# EAGLE design nrfMysensor (EAGLE 6.5.0)
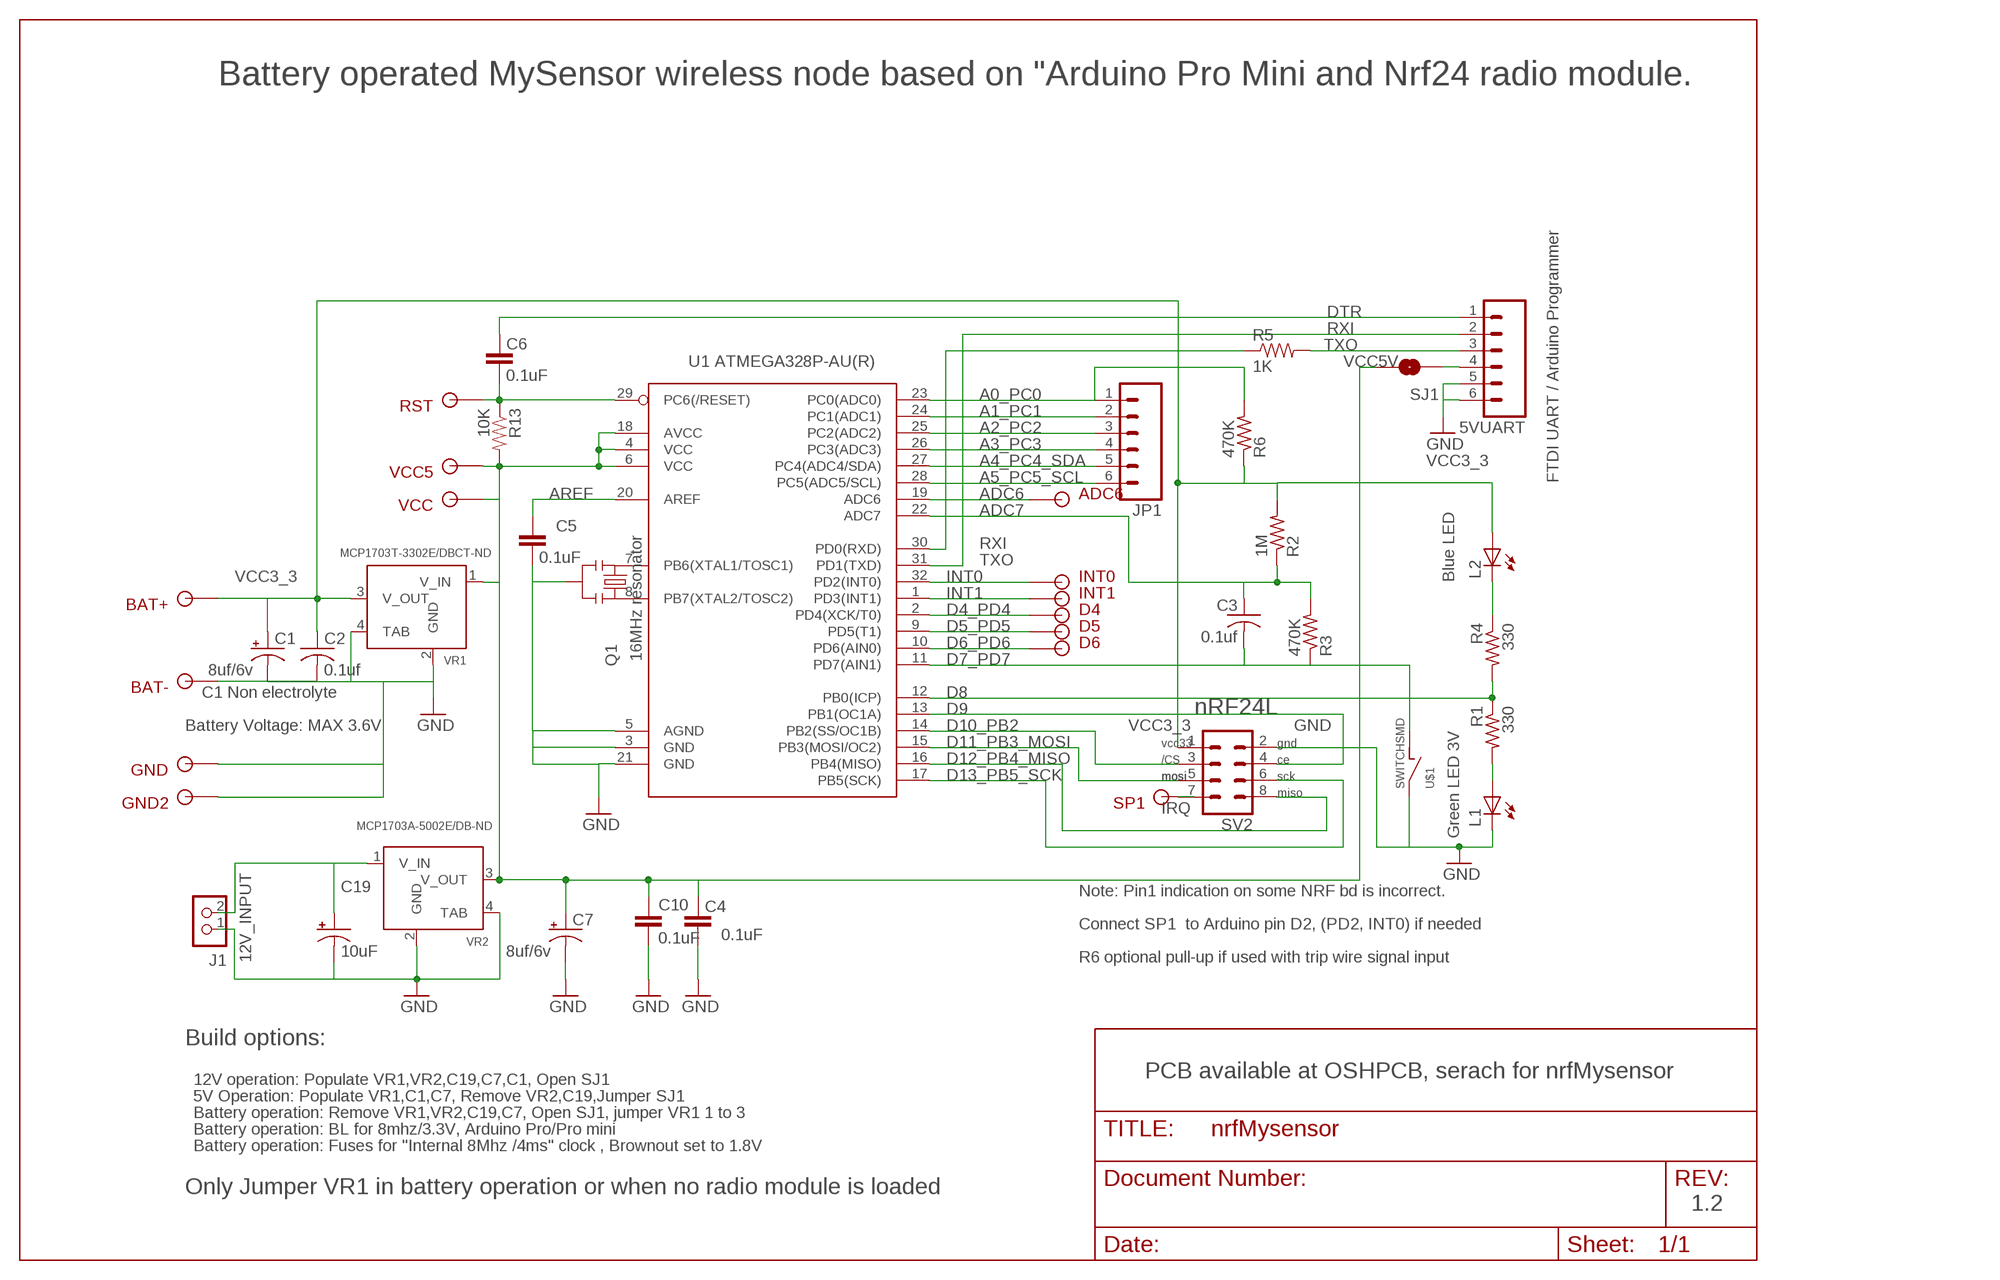
[diagram p0: schematic, sheet 1]

## Parts
5VUART  M06SIP  [1X06]
ADC6  SOLDER_POINTA  [P1-13]
BAT+  SOLDER_POINTA  [P1-13]
BAT-  SOLDER_POINTA  [P1-13]
C1  8uf/6v  CPOL-USSMCB  [SMC_B]
C2  0.1uf  C-USC0805  [C0805]
C3  0.1uf  C-USC0805  [C0805]
C4  0.1uF  CAP0805  [0805]
C5  0.1uF  CAP0805  [0805]
C6  0.1uF  CAP0805  [0805]
C7  8uf/6v  CPOL-USSMCB  [SMC_B]
C10  0.1uF  CAP0805  [0805]
C19  10uF  CAP_POL7343  [EIA7343]
D4  SOLDER_POINTA  [P1-13]
D5  SOLDER_POINTA  [P1-13]
D6  SOLDER_POINTA  [P1-13]
GND  SOLDER_POINTA  [P1-13]
GND2  SOLDER_POINTA  [P1-13]
INT0  SOLDER_POINTA  [P1-13]
INT1  SOLDER_POINTA  [P1-13]
J1  12V input  CON_HEADER_1X02-PTH  [M1X2]
JP1  M06SIP  [1X06]
L1  LEDSML0603  [SML0603]
L2  LEDSML0603  [SML0603]
Q1  16MHz resonator  RESONATORSMD  [RESONATOR-SMD]
R1  330  R-US_R0603  [R0603]
R2  1M  R-US_R0603  [R0603]
R3  470K  R-US_R0603  [R0603]
R4  330  R-US_R0603  [R0603]
R5  1K  RESISTOR0603  [0603]
R6  470K  R-US_R0603  [R0603]
R13  10K  RESISTOR0603  [0603]
RST  SOLDER_POINTA  [P1-13]
SJ1  SOLDERJUMPERNO  [SJ_2S-NO]
SP1  SOLDER_POINTA  [P1-13]
SV2  MA04-2  [MA04-2]
U1  ATMEGA328P-AU(R)  ATMEGA168  [TQFP32-08]
U$1  SWITCHSMD  [SMD_SWITCH]
VCC  SOLDER_POINTA  [P1-13]
VCC5  SOLDER_POINTA  [P1-13]
VR1  MCP1703T-3302E/DBCT-ND  MCP1703ASOT223  [SOT223]
VR2  MCP1703A-5002E/DB-ND  MCP1703ASOT223  [SOT223]

## Nets
5V: C4.2 C7.+ C10.1 R13.2 SJ1.1 U1.4(VCC) U1.6(VCC) U1.18(AVCC) VCC5.1 VCC.1 VR1.1(V_IN) VR2.3(V_OUT)
12V_INPUT: C19.A(+) J1.2 VR2.1(V_IN)
A0_PC0: JP1.1 R6.2 U1.23(PC0(ADC0))
A1_PC1: JP1.2 U1.24(PC1(ADC1))
A2_PC2: JP1.3 U1.25(PC2(ADC2))
A3_PC3: JP1.4 U1.26(PC3(ADC3))
A4_PC4_SDA: JP1.5 U1.27(PC4(ADC4/SDA))
A5_PC5_SCL: JP1.6 U1.28(PC5(ADC5/SCL))
ADC6: ADC6.1 U1.19(ADC6)
ADC7: C3.1 R2.1 R3.2 U1.22(ADC7)
AREF: C5.2 U1.20(AREF)
D4_PD4: D4.1 U1.2(PD4(XCK/T0))
D5_PD5: D5.1 U1.9(PD5(T1))
D6_PD6: D6.1 U1.10(PD6(AIN0))
D7_PD7: C3.2 R3.1 U1.11(PD7(AIN1)) U$1.P$1
D8: R1.1 R4.2 U1.12(PB0(ICP))
D9: SV2.4 U1.13(PB1(OC1A))
D10_PB2: SV2.3 U1.14(PB2(SS/OC1B))
D11_PB3_MOSI: SV2.5 U1.15(PB3(MOSI/OC2))
D12_PB4_MISO: SV2.8 U1.16(PB4(MISO))
D13_PB5_SCK: SV2.6 U1.17(PB5(SCK))
GND: 5VUART.5 5VUART.6 BAT-.1 C1.- C2.2 C4.1 C5.1 C7.- C10.2 C19.C(-) GND2.1 GND.1 J1.1 L1.C Q1.2 SV2.2 U1.3(GND) U1.5(AGND) U1.21(GND) U$1.P$2 VR1.2(GND) VR1.4(TAB) VR2.2(GND) VR2.4(TAB)
INT0: INT0.1 U1.32(PD2(INT0))
INT1: INT1.1 U1.1(PD3(INT1))
IRQ: SP1.1 SV2.7
N$1: L1.A R1.2
N$2: L2.C R4.1
N$3: 5VUART.3 R5.2
N$4: 5VUART.4 SJ1.2
N$5: Q1.1 U1.8(PB7(XTAL2/TOSC2))
N$6: 5VUART.1 C6.2
N$9: Q1.3 U1.7(PB6(XTAL1/TOSC1))
RESET: C6.1 R13.1 RST.1 U1.29(PC6(/RESET))
RXI: R5.1 U1.30(PD0(RXD))
TXO: 5VUART.2 U1.31(PD1(TXD))
VCC3_3: BAT+.1 C1.+ C2.1 L2.A R2.2 R6.1 SV2.1 VR1.3(V_OUT)

## Notes on the sheet
- Battery operated MySensor wireless node based on "Arduino Pro Mini and Nrf24 radio module.
- DTR
- RXI
- TXO
- VCC5V
- FTDI UART / Arduino Programmer
- Blue LED
- C1 Non electrolyte
- nRF24L
- Battery Voltage: MAX 3.6V | Green LED 3V
- vcc33 | gnd
- /CS | ce
- mosi | mosi | sck
- miso
- Note: Pin1 indication on some NRF bd is incorrect.
- Connect SP1  to Arduino pin D2, (PD2, INT0) if needed
- R6 optional pull-up if used with trip wire signal input
- Build options:
- PCB available at OSHPCB, serach for nrfMysensor
- 12V operation: Populate VR1,VR2,C19,C7,C1, Open SJ1
- 5V Operation: Populate VR1,C1,C7, Remove VR2,C19,Jumper SJ1
- Battery operation: Remove VR1,VR2,C19,C7, Open SJ1, jumper VR1 1 to 3
- Battery operation: BL for 8mhz/3.3V, Arduino Pro/Pro mini
- Battery operation: Fuses for "Internal 8Mhz /4ms" clock , Brownout set to 1.8V
- Only Jumper VR1 in battery operation or when no radio module is loaded
- 1.2

## Library data of the parts
5VUART JP1 = SparkFun-Connectors:M06: Header 6 Standard 6-pin 0.1" header. Use with straight break away headers (SKU : PRT-00116), right angle break away headers (PRT-00553), swiss pins (PRT-00743), machine pins (PRT-00117), and female headers (PRT-00115). Molex polarized connector foot print use with SKU : PRT-08094 with associated crimp pins and housings. NOTES ON THE VARIANTS LOCK and LOCK_LONGPADS... This footprint was designed to help hold the alignment of a through-hole component (i.e. 6-pin header) while soldering it into place. You may notice that each hole has been shifted either up or down by 0.005 of an inch from it's more standard position (which is a perfectly straight line). This slight alteration caused the pins (the squares in the middle) to touch the edges of the holes. Because they are alternating, it causes a "brace" to hold the component in place. 0.005 has proven to be the perfect amount of "off-center" position when using our standard breakaway headers. Although looks a little odd when you look at the bare footprint, once you have a header in there, the alteration is very hard to notice. Also, if you push a header all the way into place, it is covered up entirely on the bottom side. This idea of altering the position of holes to aid alignment will be further integrated into the Sparkfun Library for other footprints. It can help hold any component with 3 or more connection pins.
ADC6 BAT+ BAT- D4-D6 GND GND2 INT0 INT1 RST SP1 VCC VCC5 = 1AA_Stofer:SOLDER_POINT
C1 C7 = rcl:CPOL-US: POLARIZED CAPACITOR, American symbol
C2 C3 = rcl:C-US: CAPACITOR, American symbol
C4-C6 C10 = SparkFun:CAP: Capacitor Standard 0603 ceramic capacitor, and 0.1" leaded capacitor.
C19 = SparkFun:CAP_POL: Capacitor Polarized These are standard SMD and PTH capacitors. Normally 10uF, 47uF, and 100uF in electrolytic and tantalum varieties. Always verify the external diameter of the through hole cap, it varies with capacity, voltage, and manufacturer. The EIA devices should be standard.
J1 = dp_devices:CON_HEADER_1X02
L1 L2 = led:LED: LED OSRAM: - CHIPLED LG R971, LG N971, LY N971, LG Q971, LY Q971, LO R971, LY R971 LH N974, LH R974 LS Q976, LO Q976, LY Q976 LO Q996 - Hyper CHIPLED LW Q18S LB Q993, LB Q99A, LB R99A - SideLED LS A670, LO A670, LY A670, LG A670, LP A670 LB A673, LV A673, LT A673, LW A673 LH A674 LY A675 LS A676, LA A676, LO A676, LY A676, LW A676 LS A679, LY A679, LG A679 - Hyper Micro SIDELED® LS Y876, LA Y876, LO Y876, LY Y876 LT Y87S - SmartLED LW L88C, LW L88S LB L89C, LB L89S, LG L890 LS L89K, LO L89K, LY L89K LS L896, LA L896, LO L896, LY L896 - TOPLED LS T670, LO T670, LY T670, LG T670, LP T670 LSG T670, LSP T670, LSY T670, LOP T670, LYG T670 LG T671, LOG T671, LSG T671 LB T673, LV T673, LT T673, LW T673 LH T674 LS T676, LA T676, LO T676, LY T676, LB T676, LH T676, LSB T676, LW T676 LB T67C, LV T67C, LT T67C, LS T67K, LO T67K, LY T67K, LW E67C LS E67B, LA E67B, LO E67B, LY E67B, LB E67C, LV E67C, LT E67C LW T67C LS T679, LY T679, LG T679 LS T770, LO T770, LY T770, LG T770, LP T770 LB T773, LV T773, LT T773, LW T773 LH T774 LS E675, LA E675, LY E675, LS T675 LS T776, LA T776, LO T776, LY T776, LB T776 LHGB T686 LT T68C, LB T68C - Hyper Mini TOPLED® LB M676 - Mini TOPLED Santana® LG M470 LS M47K, LO M47K, LY M47K Source: http://www.osram.convergy.de LUXEON: - LUMILED® LXK2-PW12-R00, LXK2-PW12-S00, LXK2-PW14-U00, LXK2-PW14-V00 LXK2-PM12-R00, LXK2-PM12-S00, LXK2-PM14-U00 LXK2-PE12-Q00, LXK2-PE12-R00, LXK2-PE12-S00, LXK2-PE14-T00, LXK2-PE14-U00 LXK2-PB12-K00, LXK2-PB12-L00, LXK2-PB12-M00, LXK2-PB14-N00, LXK2-PB14-P00, LXK2-PB14-Q00 LXK2-PR12-L00, LXK2-PR12-M00, LXK2-PR14-Q00, LXK2-PR14-R00 LXK2-PD12-Q00, LXK2-PD12-R00, LXK2-PD12-S00 LXK2-PH12-R00, LXK2-PH12-S00 LXK2-PL12-P00, LXK2-PL12-Q00, LXK2-PL12-R00 Source: www.luxeon.com KINGBRIGHT: KA-3528ASYC Source: www.kingbright.com
Q1 = SparkFun:RESONATOR: Resonator Small SMD resonator. This is the itty bitty 10/20MHz resonators with built in caps. CSTCE10M0G55 and CSTCE20M0V53. Footprint has been reviewed closely but hasn't been tested yet.
R1-R4 R6 = rcl:R-US_: RESISTOR, American symbol
R5 R13 = SparkFun:RESISTOR: Resistor Basic schematic elements and footprints for 0603, 1206, and PTH 1/10th watt (small) resistors.
SJ1 = SparkFun-Passives:SOLDERJUMPER: Solder Jumper Standard SMD solder jumper. Used to automate production. Two varients : Normally Open and Normally Closed are the same, but have different paste layers. NC will have a large amount of paste and should jumper during reflow.
SV2 = con-lstb:MA04-2: PIN HEADER; OC_FARNELL: unknown; OC_NEWARK: unknown
U1 = SparkFun:ATMEGA168
U$1 = 1AA_Stofer:SWITCH
VR1 VR2 = 1AA_Stofer:MCP1703A

## Board
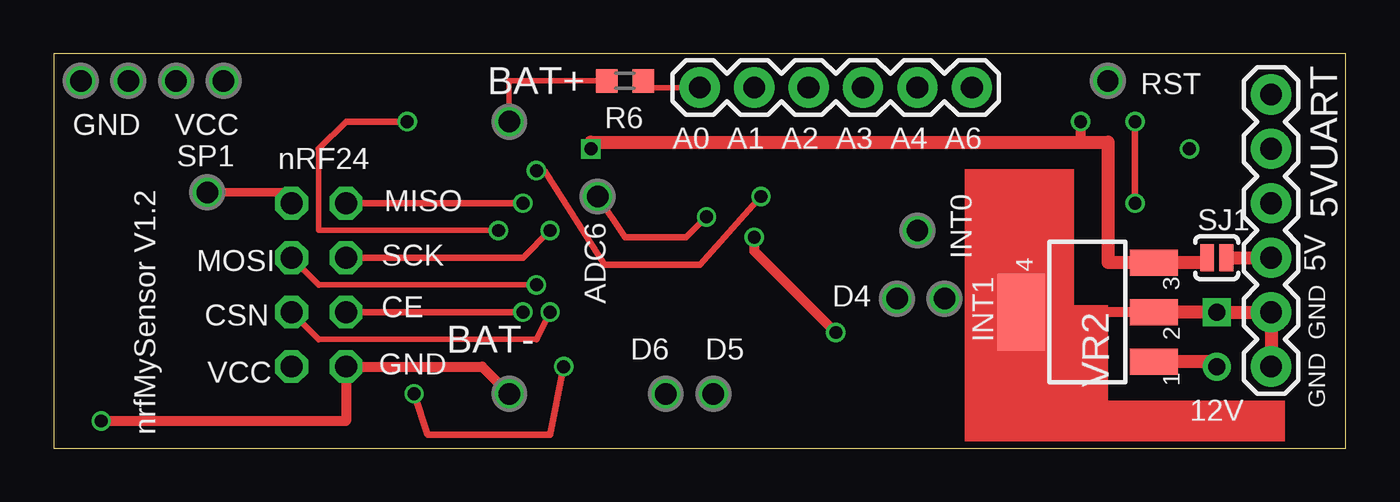
[diagram p1: board, top side]
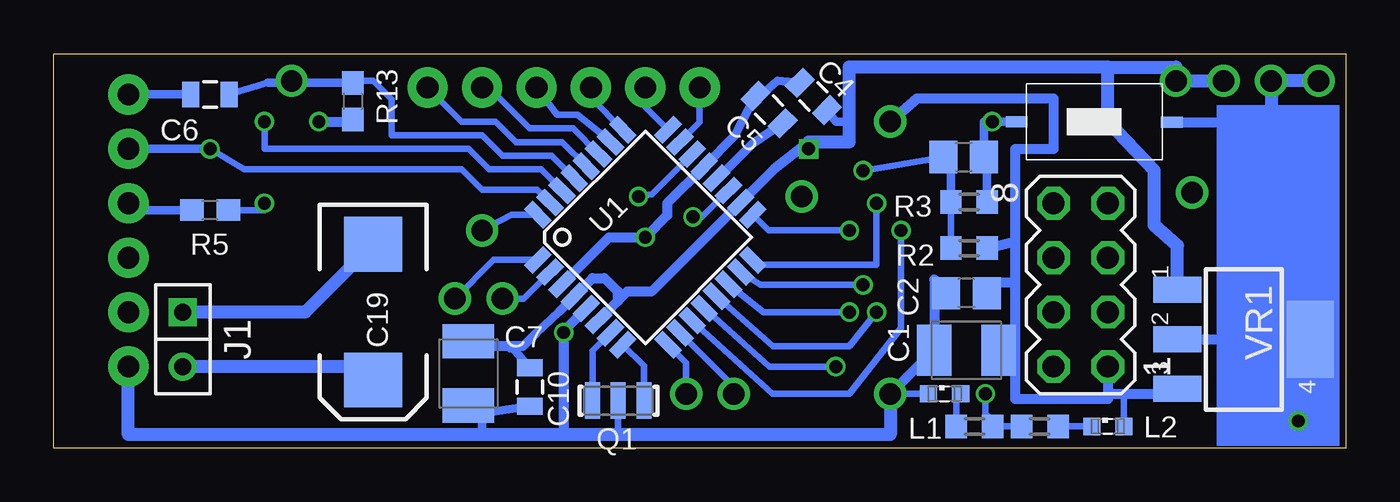
[diagram p2: board, bottom side, seen from below]

Size 60.32 x 18.41 mm. Coordinates in mm from the lower left corner, seen from the top.
Outline: 0,0 60.32,0 60.32,18.41 0,18.41 0,0
Copper layers (1*16): Top 0.035mm / dielectric 1.5mm / Bottom 0.035mm
Design rules "Elecrow_2-layer_eagle_rule": minimum track width 6mil, minimum drill 12mil, track to track 6mil, track to pad 6mil, pad to pad 6mil, via to via 6mil, smd to smd 0mil, copper to edge 10mil, drill to drill 10mil, minimum pad ring 10mil, minimum via ring 6mil, stop-mask expansion 2mil, vias tented up to drill 100mil, thermal gap 10mil

### Footprints (pad centres in the part's own frame; a part is rotated, then mirrored left to right if it is on the bottom)
1X06 = drill 1.016 pad 1.88: 1 0,0; 2 2.54,0; 3 5.08,0; 4 7.62,0; 5 10.16,0; 6 12.7,0
P1-13 = drill 1: 1 0,0
SMC_B = smd 1.6 x 2.4: + -1.5,0; - 1.5,0
C0805 = smd 1.3 x 1.5: 1 -0.95,0; 2 0.95,0
0805 = smd 0.8 x 1.2: 1 -0.9,0; 2 0.9,0
EIA7343 = smd 2.55 x 2.7: A 3.17,0; C -3.17,0
M1X2 = drill 0.8 square: 1 -1.27,0 | drill 0.8: 2 1.27,0
SML0603 = smd 0.8 x 0.8: A 0.75,0; C -0.75,0
RESONATOR-SMD = smd 0.7 x 1.7: 1 -1.2,0; 2 0,0; 3 1.2,0
R0603 = smd 1 x 1.1: 1 -0.85,0; 2 0.85,0
0603 = smd 1.1 x 1: 1 -0.85,0; 2 0.85,0
SJ_2S-NO = smd 0.635 x 1.27: 1 -0.45,0; 2 0.45,0
MA04-2 = drill 1.016 octagon: 1 -3.81,-1.27; 2 -3.81,1.27; 3 -1.27,-1.27; 4 -1.27,1.27; 5 1.27,-1.27; 6 1.27,1.27; 7 3.81,-1.27; 8 3.81,1.27
TQFP32-08 = smd 1.27 x 0.559: 1 -4.293,2.8; 2 -4.293,2; 3 -4.293,1.2; 4 -4.293,0.4; 5 -4.293,-0.4; 6 -4.293,-1.2; 7 -4.293,-2; 8 -4.293,-2.8; 17 4.293,-2.8; 18 4.293,-2; 19 4.293,-1.2; 20 4.293,-0.4; 21 4.293,0.4; 22 4.293,1.2; 23 4.293,2; 24 4.293,2.8 | smd 0.559 x 1.27: 9 -2.8,-4.293; 10 -2,-4.293; 11 -1.2,-4.293; 12 -0.4,-4.293; 13 0.4,-4.293; 14 1.2,-4.293; 15 2,-4.293; 16 2.8,-4.293; 25 2.8,4.293; 26 2,4.293; 27 1.2,4.293; 28 0.4,4.293; 29 -0.4,4.293; 30 -1.2,4.293; 31 -2,4.293; 32 -2.8,4.293
SMD_SWITCH = smd 1.016 x 0.508: P$1 -4.259,-0.005; P$2 2.988,-0.021
SOT223 = smd 1.219 x 2.235: 1 -2.311,-3.099; 2 0,-3.099; 3 2.311,-3.099 | smd 3.6 x 2.2: 4 0,3.099

### Placement (x,y rotation side)
5VUART  56.83,16.51 270 top
ADC6  25.4,11.75 0 top
BAT+  21.27,15.24 0 top
BAT-  21.27,2.54 0 top
C1  17.72,4.57 180 bottom
C2  17.72,7.24 180 bottom
C3  17.84,13.59 0 bottom
C4  24.86,16.42 315 bottom
C5  26.93,15.8 315 bottom
C6  53.02,16.51 180 bottom
C7  40.96,3.49 270 bottom
C10  38.1,2.86 270 bottom
C19  45.4,6.35 270 bottom
D4  39.37,6.99 0 top
D5  30.8,2.54 0 top
D6  28.57,2.54 0 top
GND  1.27,17.14 0 top
GND2  3.49,17.14 0 top
INT0  40.32,10.16 0 top
INT1  41.59,6.99 0 top
J1  54.29,5.08 270 bottom
JP1  30.16,16.83 0 top
L1  18.73,2.54 0 bottom
L2  11.11,1.02 0 bottom
Q1  33.97,2.22 180 bottom
R1  17.34,1.02 180 bottom
R2  17.59,9.33 0 bottom
R3  17.59,11.49 180 bottom
R4  14.29,1.02 180 bottom
R5  53.02,11.11 180 bottom
R6  26.67,17.14 0 top
R13  46.35,16.19 270 bottom
RST  49.21,17.14 0 top
SJ1  54.29,8.89 0 top
SP1  7.18,11.94 0 top
SV2  12.38,7.62 90 bottom
U1  32.7,9.84 45 bottom
U$1  11.11,15.24 0 bottom
VCC  5.71,17.14 0 top
VCC5  7.94,17.14 0 top
VR1  4.76,5.08 270 bottom
VR2  48.26,6.35 90 top

### Tracks (layer width: path | path; a pad name or v marks a point on that pad's centre or on a via)
5V  (via drill 0.6)
  Top 0.457: 47.94,14.29 v47.94,15.24
  Top 0.61: SJ1.1 53.61,8.66 VR2.3 49.23,8.66 49.23,14.29 47.94,14.29 25.08,14.29 v25.08,13.97
  Bottom 0.406: C4.2 23.81,15.24 23.18,15.24 | U1.4 36.76,6.35 37.78,5.4 38.42,4.76 | 38.92,4.71 C10.1
  Bottom 0.457: U1.4 35.17,7.94 34.61,7.94 33.97,7.3 33.97,6.88 U1.6 33.55,7.3 32.41,7.3 U1.18 26.7,13.02 25.08,14.29 | v47.94,15.24 46.46,15.24 R13.2 | 38.42,4.76 39.05,4.76 | 39.05,4.76 40.73,4.76 C7.+ | 38.92,4.71 39,4.71 39.05,4.76
  Bottom 0.61: VR1.1 7.86,9.45 8.95,10.41 8.95,12.95 11.11,15.24 11.11,17.78 | 11.11,17.78 23.18,17.78 23.18,15.24 23.18,14.29 25.08,14.29 v25.08,13.97 | 11.11,17.78 7.94,17.78 VCC5.1 VCC.1
12V_INPUT
  Top 0.61: J1.2 54.06,4.04 VR2.1
  Bottom 0.61: C19.A 46.03,3.81 J1.2
A0_PC0
  Top 0.254: JP1.1 27.52,16.83 R6.2
  Bottom 0.305: U1.23 30.16,15.21 JP1.1
A1_PC1
  Bottom 0.305: U1.24 32.7,15.91 JP1.2
A2_PC2
  Bottom 0.305: U1.25 35.24,16.34 JP1.3
A3_PC3
  Bottom 0.305: U1.26 34.32,14.32 35.88,15.56 36.83,15.56 JP1.4
A4_PC4_SDA
  Bottom 0.305: U1.27 36.09,14.92 38.1,14.92 40,16.83 JP1.5
A5_PC5_SCL
  Bottom 0.305: U1.28 36.58,14.29 38.74,14.29 39.69,15.24 41.28,15.24 JP1.6
ADC6  (via drill 0.6)
  Top 0.305: v30.48,10.79 29.53,9.84 26.67,9.84 ADC6.1
  Bottom 0.305: U1.19 30.05,10.79 v30.48,10.79
ADC7  (via drill 0.6)
  Top 0.305: v33.02,11.75 30.16,8.57 25.72,8.57 22.92,12.95 v22.54,12.95
  Bottom 0.305: R3.2 R2.1 | C3.1 v22.54,12.95 | U1.22 32.39,11.86 v33.02,11.75
  Bottom 0.406: R3.2 18.44,12.95 C3.1
AREF
  Bottom 0.305: 29.32,12.6 U1.20
  Bottom 0.406: 29.32,12.6 27.7,14.21 C5.2
D4_PD4
  Bottom 0.305: U1.2 38.39,6.99 D4.1
D5_PD5
  Bottom 0.305: U1.9 30.8,3.98 D5.1
D6_PD6
  Bottom 0.305: U1.10 28.56,2.87 | 28.56,2.87 28.26,2.57 | D6.1 28.57,2.86 28.56,2.87
D7_PD7  (via drill 0.6)
  Top 0.254: 12.38,13.97 12.38,10.16 v20.76,10.16
  Top 0.305: v16.51,15.24 13.65,15.24 12.38,13.97
  Bottom 0.305: 16.89,15.23 16.9,15.24 v16.51,15.24 | v20.76,10.16 20.76,5.59 23.18,2.54 26.78,2.54 U1.11
  Bottom 0.406: U$1.P$1 16.89,15.23 C3.2 16.77,12.83 16.77,11.33 R3.1
D8  (via drill 0.6)
  Top 0.305: v16.83,2.54 17.46,0.64 23.18,0.64 v23.81,3.81
  Bottom 0.305: R4.2 R1.1 16.49,1.27 16.83,1.61 v16.83,2.54 | U1.12 26.92,3.81 v23.81,3.81
D9  (via drill 0.6)
  Top 0.305: v21.91,6.35 SV2.4
  Bottom 0.305: U1.13 26.74,4.76 23.18,4.76 v21.91,6.35
D10_PB2  (via drill 0.6)
  Top 0.254: 12.38,5.08 22.54,5.08
  Top 0.305: SV2.3 12.38,5.08 | v23.18,6.35 22.54,5.08
  Bottom 0.305: U1.14 27.2,6.35 v23.18,6.35
D11_PB3_MOSI  (via drill 0.6)
  Top 0.254: 12.38,7.62 v22.54,7.62
  Top 0.305: 12.38,7.62 SV2.5
  Bottom 0.305: U1.15 27.33,7.62 v22.54,7.62
D12_PB4_MISO  (via drill 0.6)
  Top 0.305: v21.91,11.43 SV2.8
  Bottom 0.305: U1.16 27.47,8.57 21.91,8.57 v21.91,11.43
D13_PB5_SCK  (via drill 0.6)
  Top 0.305: SV2.6 21.91,8.89 v23.18,10.16
  Bottom 0.305: U1.17 26.95,10.16 v23.18,10.16
GND  (via drill 0.6)
  Top 0.457: BAT-.1 20,3.81 SV2.2 13.65,1.27 v2.22,1.27 | v32.7,9.84 32.7,9.21 v36.51,5.4 | VR2.2 VR2.4
  Top 0.61: VR2.2 J1.1 5VUART.5 5VUART.6
  Bottom 0.305: L1.C BAT-.1 | Q1.2 33.97,0.64
  Bottom 0.406: C4.1 26.54,17.14 27.62,16.19 27.38,16.44 C5.1 28.52,14.59 U1.21 | C10.2 40.32,1.64 40.32,1.27 40.32,0.64
  Bottom 0.457: VR1.2 3.49,5.08 | 3.49,5.08 2.22,5.08 | 2.22,5.08 VR1.4 | U$1.P$2 3.49,15.22 | 3.49,15.22 3.49,15.24 | 3.49,15.22 3.49,5.08 | v2.22,1.27 2.22,5.08 | C2.2 19.22,7.87 C1.- 19.75,4.06 BAT-.1 | U1.21 31.68,11.43 31.68,10.86 v32.7,9.84 34.4,9.84 U1.3 | U1.5 36.51,5.47 v36.51,5.4 36.51,0.64 | C7.- 40.32,1.99 40.32,1.27
  Bottom 0.61: BAT-.1 21.27,0.64 33.97,0.64 36.51,0.64 40.32,0.64 56.83,0.64 5VUART.6 | C19.C 48.57,6.35 J1.1 | GND.1 GND2.1 3.49,15.24
INT0
  Bottom 0.305: U1.32 38.95,10.9 INT0.1
INT1
  Bottom 0.305: U1.1 39.79,8.79 INT1.1
IRQ
  Top 0.406: SV2.7 arc90 10.6,11.94 SP1.1
N$1
  Bottom 0.305: L1.A 18.19,2.34 R1.2
N$2
  Bottom 0.305: L2.C R4.1
N$3
  Bottom 0.406: R5.2 56.83,11.11 5VUART.3
N$4
  Top 0.61: SJ1.2 5VUART.4
N$5
  Bottom 0.305: U1.8 32.77,3.84 Q1.1
N$6
  Bottom 0.406: C6.2 5VUART.1
N$9
  Bottom 0.305: U1.7 35.17,4.54 Q1.3
RESET
  Bottom 0.305: U1.29 37.08,13.65 39.37,13.65 40.32,14.61 44.55,14.61 44.55,16.3 45.4,17.14 46.25,17.14 R13.1 | 50.32,17.04 C6.1
  Bottom 0.406: R13.1 49.21,17.04 | 50.32,17.04 49.21,17.04 | 49.21,17.04 RST.1
RXI  (via drill 0.6)
  Top 0.305: v50.48,11.43 v50.48,15.24
  Bottom 0.305: U1.30 37.57,13.02 40,13.02 40.96,13.97 50.48,13.97 v50.48,15.24 | R5.1 50.48,11.11 v50.48,11.43
TXO  (via drill 0.6)
  Bottom 0.305: U1.31 37.75,12.07 40.32,12.07 41.28,13.02 51.43,13.02 v53.02,13.97
  Bottom 0.406: v53.02,13.97 5VUART.2
VCC3_3
  Top 0.254: R6.1 21.27,17.14 BAT+.1
  Bottom 0.305: L2.A 10.36,2.54 9.84,2.54
  Bottom 0.457: 11.11,2.54 9.84,2.54 7.3,2.54 7.3,2.77 VR1.3 | BAT+.1 20,16.32 13.65,16.32 13.65,13.97 15.43,13.97 15.43,9.65 | SV2.1 11.11,2.54 | 15.43,5.08 15.43,2.29 11.11,2.29 11.11,2.54 | 15.43,5.08 15.43,7.75 | 15.43,7.75 15.43,9.65 | C1.+ 15.43,5.08 | C2.1 16.64,7.75 15.43,7.75 | R2.2 15.43,9.65
(copper drawn outside any net)
  shapes: Bottom area x1, Top area x3

### Text on the board
tPlace: nRF24
tNames: A0 | A1 | A2 | A3 | A4 | A6 | MISO | MOSI | SCK | 5V | CSN | CE | GND | GND | VCC | 12V | GND | nrfMySensor V1.2